# Altium schematic sheet ui_xte_usb.SchDoc: mcHF Pro Transceiver UI board
size A3; Author: Krassi Atanassov; CompanyName: MØNKA; Engineer: For radio amateurs experimentation, non-commercial use only. Thank you!; Revision: 0.8.2; SheetTotal: 18
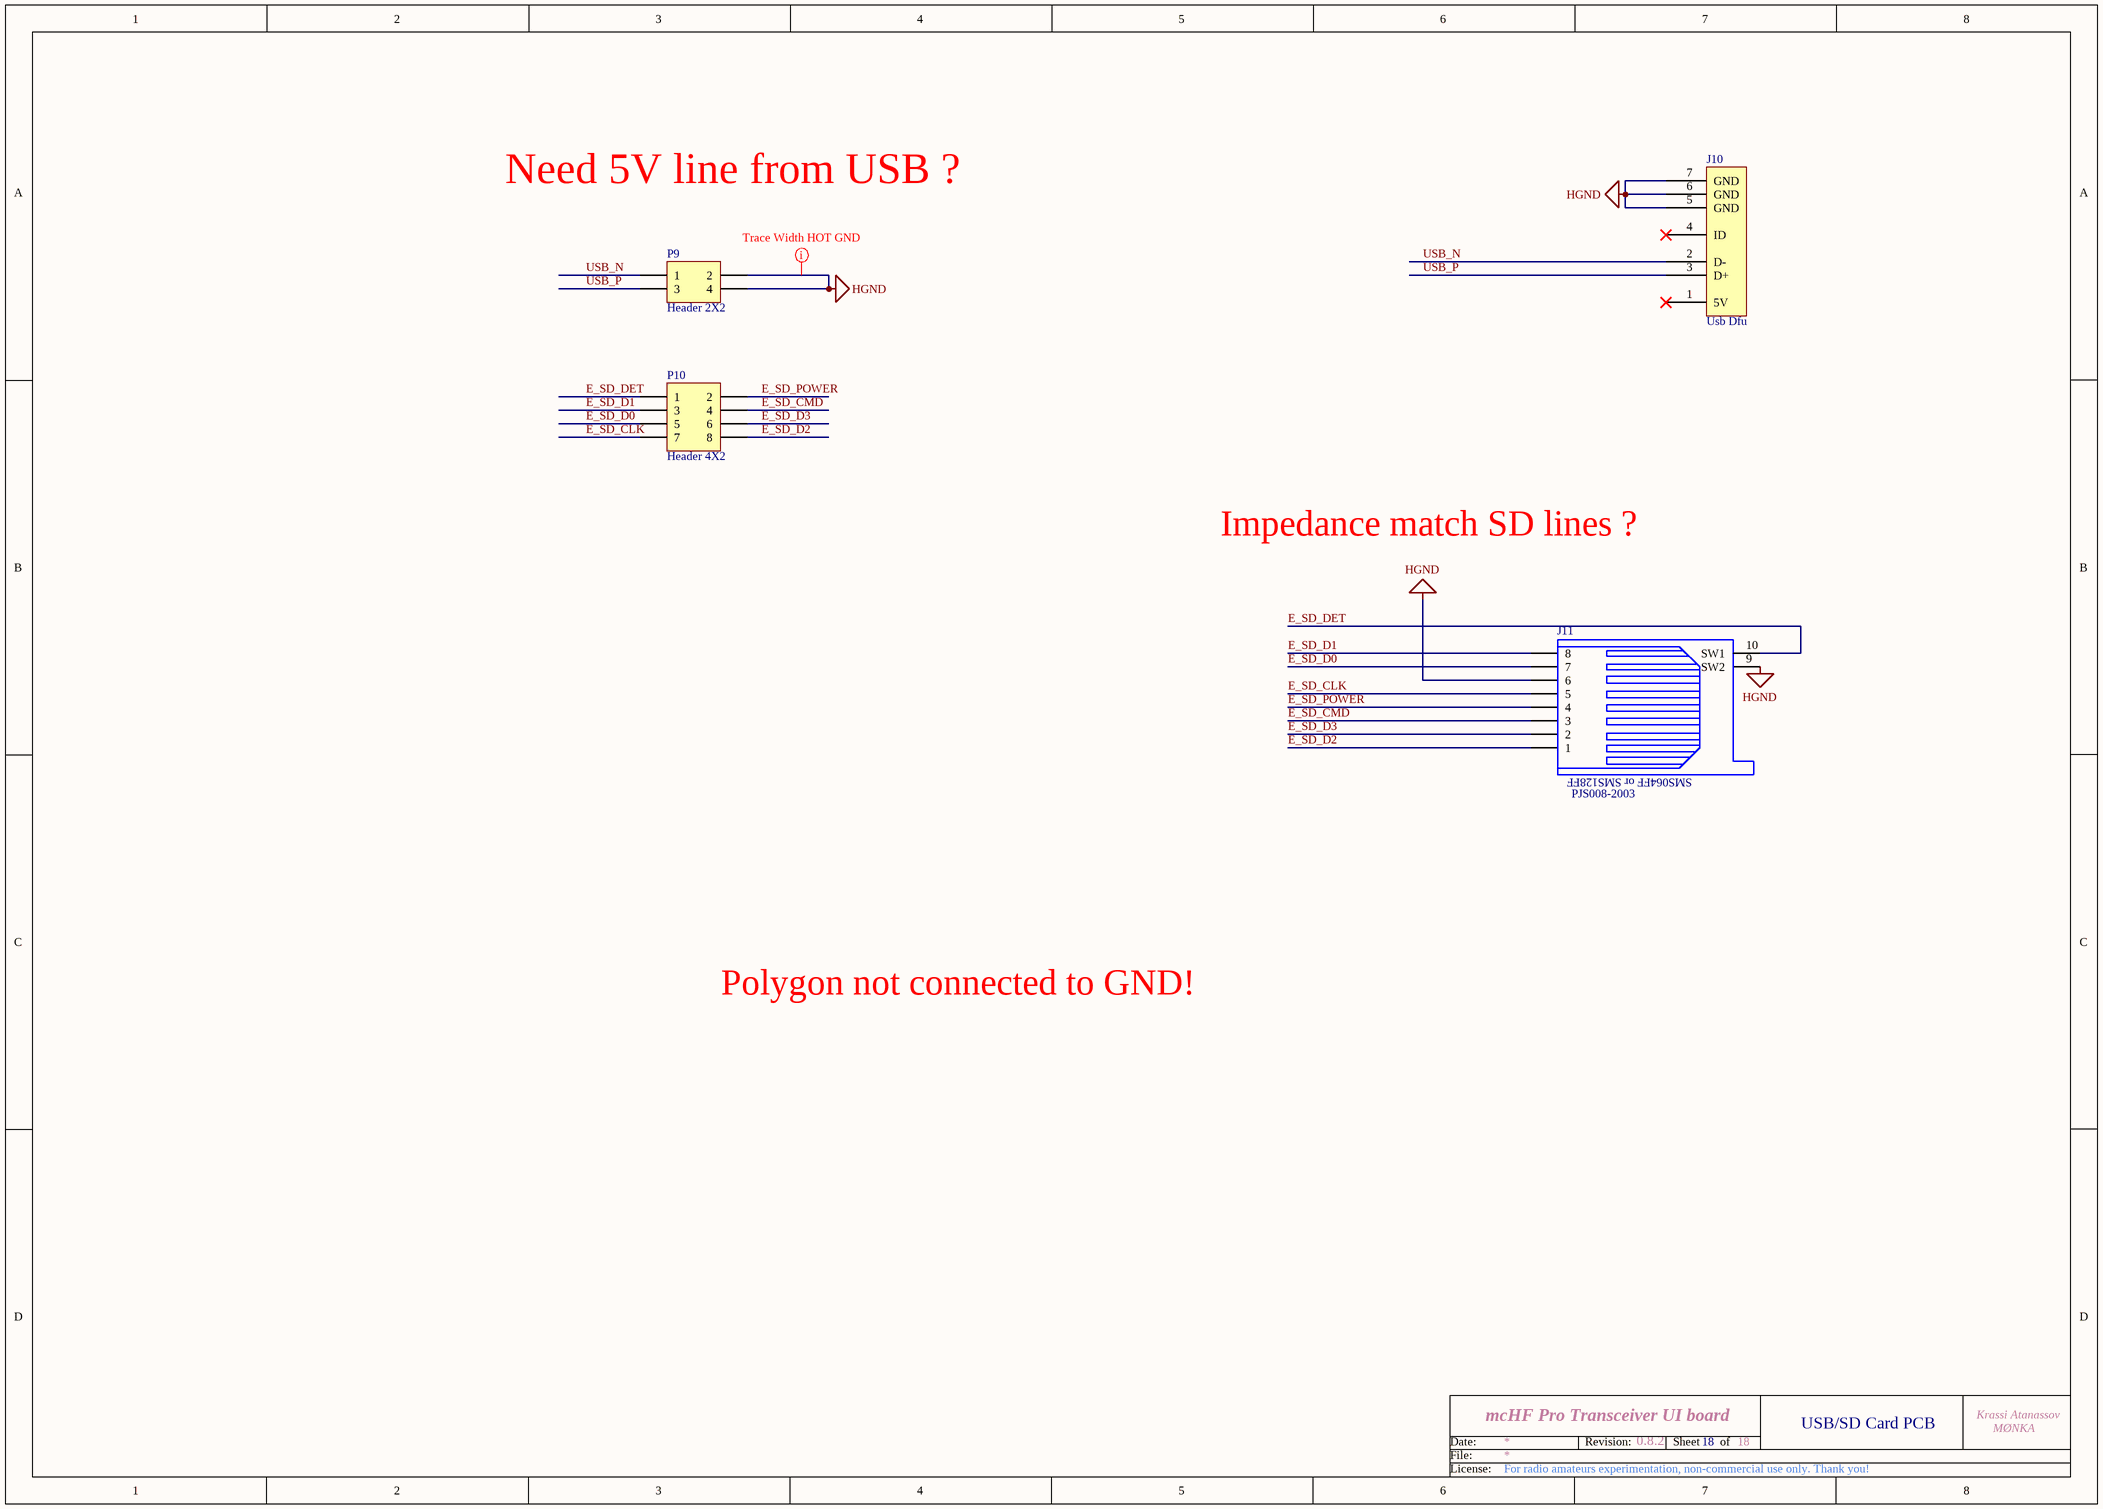
[diagram p0: ui_xte_usb.SchDoc]

## Parts
J10  Usb Dfu  [MINI_USB_B_SMD]
J11  PJS008-2003  [PJS008-2003-1]
P9  Header 2X2  [HDR2X2R]
P10  Header 4X2  [HDR2X4R]

## Nets
HGND: J10.5(GND) J10.6(GND) J10.7(GND) J11.6 J11.9(SW2) P9.2 P9.4
E_SD_CLK: J11.5 P10.7
E_SD_CMD: J11.3 P10.4
E_SD_D0: J11.7 P10.5
E_SD_D1: J11.8 P10.3
E_SD_D2: J11.1 P10.8
E_SD_D3: J11.2 P10.6
E_SD_DET: J11.10(SW1) P10.1
E_SD_POWER: J11.4 P10.2
USB_N: J10.2(D-) P9.1
USB_P: J10.3(D+) P9.3

Not connected (* = marked no-connect by the designer): J10 1(5V)* 4(ID)*

## Layout directives
rule Width Constraint [Pref Width = 30mil    Min Width = 30mil    Max Width = 30mil]: HGND

## Notes on the sheet
- Need 5V line from USB ?
- Impedance match SD lines ?
- (near J11) SMS064FF or SMS128FF
- Polygon not connected to GND!
- 18
- USB/SD Card PCB
- Date:
- File:
- Revision:
- Sheet
- of
- License:

## Library data of the parts
J10 = MINI_USB_B: Mini USB connector; Order: FN 211-2367; QT Order: QCJ-00083; Price: 0.62
J11 = microSD-PJS008-2003: Memory Card Connectors MicroSD Card Conn Revrs Mnt Push-Push; Manuf_1: YAMAICHI; Notes: need to find on Ali!; Manuf_Part_1: PJS008-2003-1; Distrib: *; Order: PJS008-2003-1; ECCN_US/EU: n/a
P9 = Header 2X2: Header, 2-Pin, Dual row; LatestRevisionDate: 17-Jul-2002; LatestRevisionNote: Re-released for DXP Platform.; Publisher: Altium Limited
P10 = Header 4X2: Header, 4-Pin, Dual row; LatestRevisionDate: 17-Jul-2002; LatestRevisionNote: Re-released for DXP Platform.; Publisher: Altium Limited